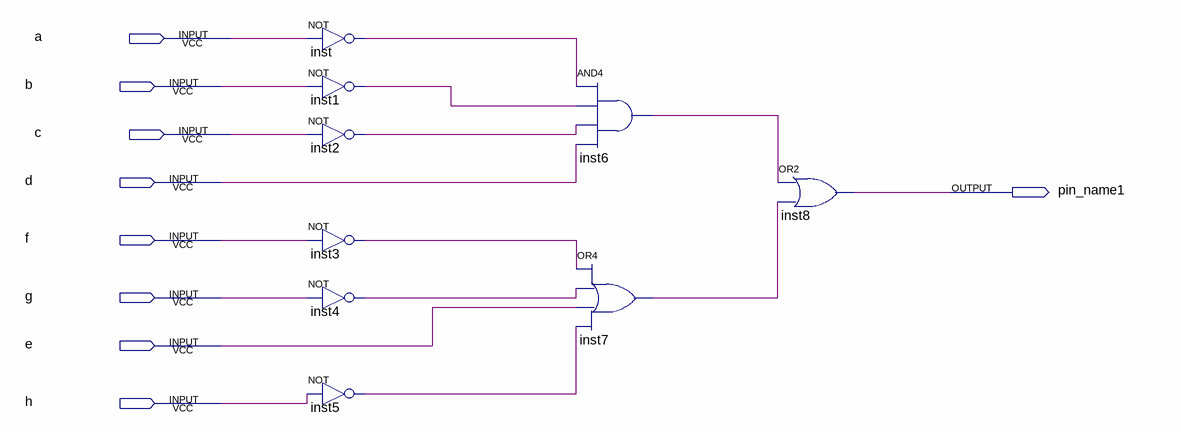
[diagram p0: schematic sheet]
// Quartus schematic Project4.bdf as structural Verilog: 9 symbols, 9 pins
module Project4 (
  input  a,
  input  b,
  input  c,
  input  d,
  input  f,
  input  g,
  input  e,
  input  h,
  output pin_name1
);

  wire inst1_out, inst2_out, inst3_out, inst4_out, inst5_out, inst6_out, inst7_out, inst_out;

  not inst (inst_out, a);
  not inst1 (inst1_out, b);
  not inst2 (inst2_out, c);
  not inst3 (inst3_out, f);
  not inst4 (inst4_out, g);
  not inst5 (inst5_out, h);
  and inst6 (inst6_out, inst_out, inst1_out, inst2_out, d);
  or inst7 (inst7_out, inst3_out, inst4_out, e, inst5_out);
  or inst8 (pin_name1, inst6_out, inst7_out);
endmodule
